# EAGLE design v1 (EAGLE 5.12)
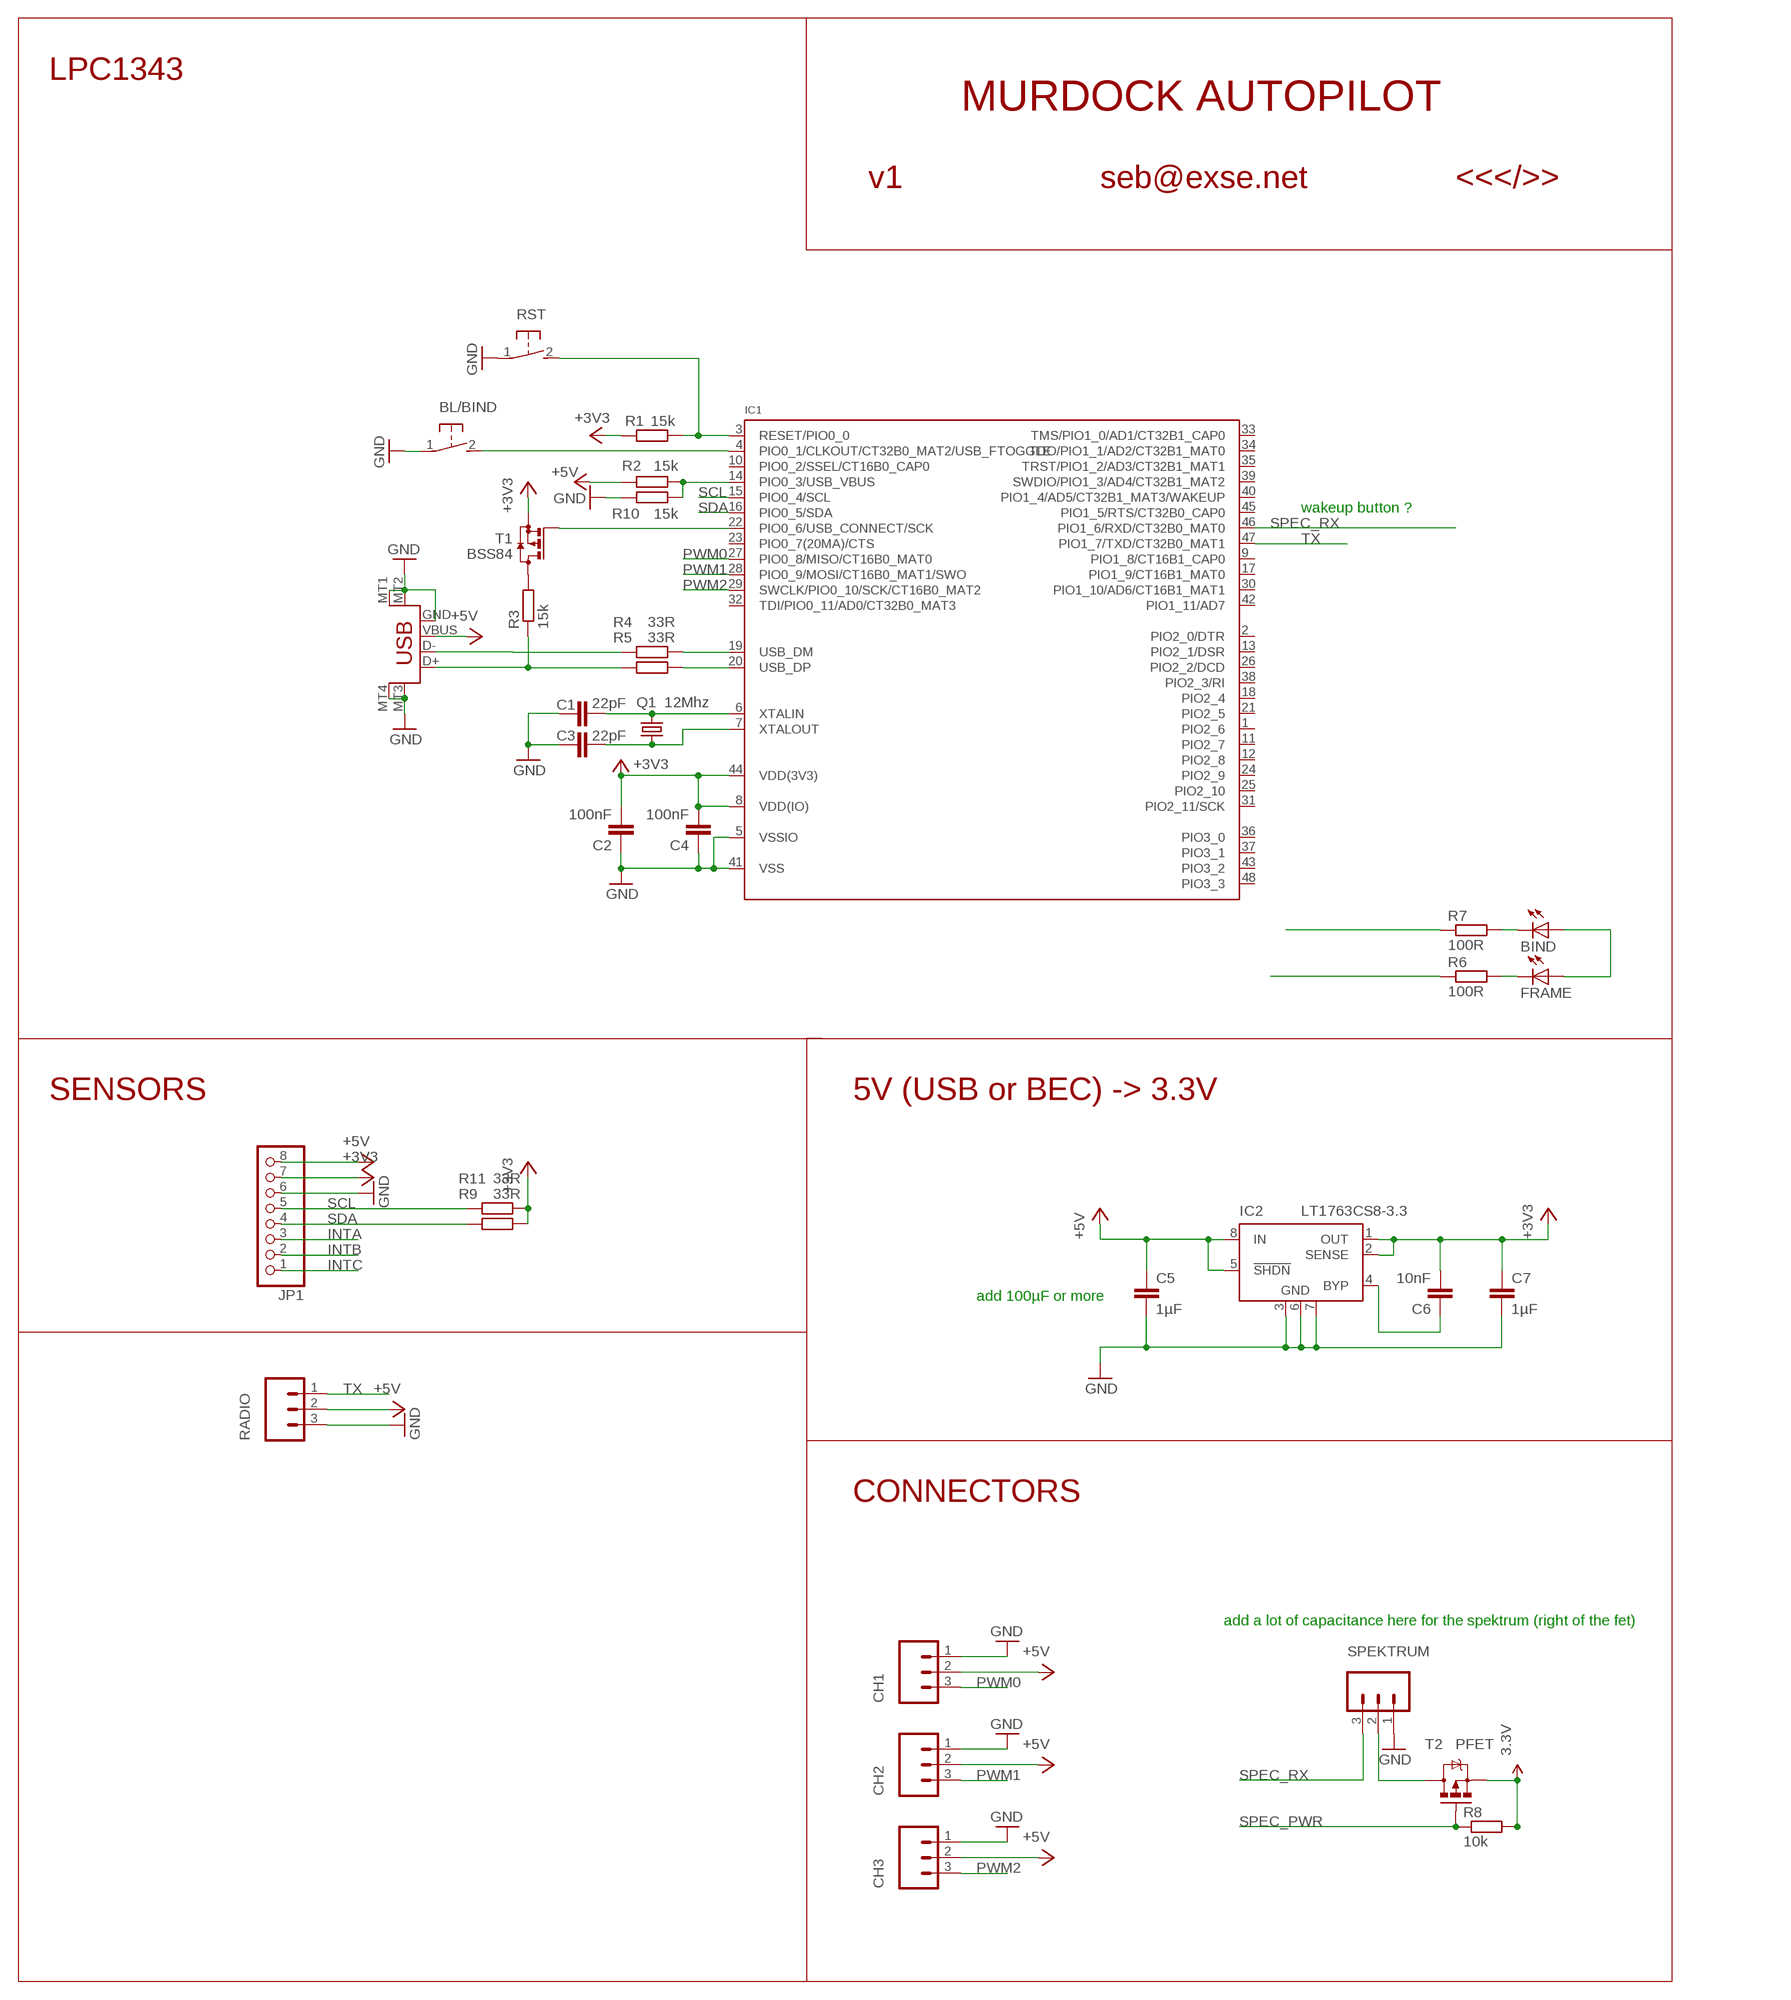
[diagram p0: schematic, sheet 1]

## Parts
BIND  LEDCHIPLED_0805  [CHIPLED_0805]
BL/BIND  SWITCH_MCTAEF  [SWITCH_MCTAEF]
C1  22pF  C-EUC0402  [C0402]
C2  100nF  C-EUC0402  [C0402]
C3  22pF  C-EUC0402  [C0402]
C4  100nF  C-EUC0402  [C0402]
C5  1µF  CAP0805  [0805]
C6  10nF  C-EUC0402  [C0402]
C7  1µF  CAP0805  [0805]
CH1  M03LONGPADS  [1X03_LONGPADS]
CH2  M03LONGPADS  [1X03_LONGPADS]
CH3  M03LONGPADS  [1X03_LONGPADS]
FRAME  LEDCHIPLED_0805  [CHIPLED_0805]
IC1  LPC1343_QFP  [LQFP48]
IC2  LT1763CS8-3.3  [SOIC8]
JP1  PINHD-1X8  [1X08]
Q1  12Mhz  MT-OSCILLATOR  [MT]
R1  15k  R-EU_R0402  [R0402]
R2  15k  R-EU_R0402  [R0402]
R3  15k  R-EU_R0402  [R0402]
R4  33R  R-EU_R0402  [R0402]
R5  33R  R-EU_R0402  [R0402]
R6  100R  R-EU_R0402  [R0402]
R7  100R  R-EU_R0402  [R0402]
R8  10k  R-EU_R0402  [R0402]
R9  33R  R-EU_R0402  [R0402]
R10  15k  R-EU_R0402  [R0402]
R11  33R  R-EU_R0402  [R0402]
RADIO  M03LONGPADS  [1X03_LONGPADS]
RST  SWITCH_MCTAEF  [SWITCH_MCTAEF]
SPEKTRUM  M03LONGPADS  [1X03_LONGPADS]
T1  BSS84  [SOT23]
T2  PFET  MOSFET-PCHANNEL  [SOT23]
X1  USB-MICROB  [USB-MICROB]

## Nets
3.3V: R8.2 T2.2(S)
+3V3: C2.2 C4.2 C6.2 C7.1 IC1.8(VDD(IO)) IC1.44(VDD(3V3)) IC2.1(OUT) IC2.2(SENSE) JP1.7 R1.2 R9.1 R11.1 T1.2(S)
+5V: C5.1 CH1.2 CH2.2 CH3.2 IC2.5(!SHDN) IC2.8(IN) JP1.8 R2.2 RADIO.2 X1.VBUS
GND: BL/BIND.1 C1.1 C2.1 C3.1 C4.1 C5.2 C7.2 CH1.1 CH2.1 CH3.1 IC1.5(VSSIO) IC1.41(VSS) IC2.3(GND) IC2.6(GND) IC2.7(GND) JP1.6 R10.2 RADIO.3 RST.1 SPEKTRUM.1 X1.GND X1.MT1(GND) X1.MT2(GND) X1.MT3(GND) X1.MT4(GND)
INTA: JP1.3
INTB: JP1.2
INTC: JP1.1
N$1: FRAME.C R6.2
N$2: SPEKTRUM.2 T2.3(D)
N$3: C3.2 IC1.7(XTALOUT) Q1.1
N$4: C1.2 IC1.6(XTALIN) Q1.3
N$5: C6.1 IC2.4(BYP)
N$6: BIND.C R7.2
N$7: IC1.3(RESET/PIO0_0) R1.1 RST.2
N$8: R3.2 T1.3(D)
N$9: IC1.22(PIO0_6/USB_CONNECT/SCK) T1.1(G)
N$10: R3.1 R5.2 X1.D+
N$11: R4.2 X1.D-
N$12: IC1.14(PIO0_3/USB_VBUS) R2.1 R10.1
N$13: R7.1
N$14: IC1.19(USB_DM) R4.1
N$15: R6.1
N$17: BIND.A FRAME.A
N$21: BL/BIND.2 IC1.4(PIO0_1/CLKOUT/CT32B0_MAT2/USB_FTOGGLE)
N$24: IC1.20(USB_DP) R5.1
PWM0: CH1.3 IC1.27(PIO0_8/MISO/CT16B0_MAT0)
PWM1: CH2.3 IC1.28(PIO0_9/MOSI/CT16B0_MAT1/SWO)
PWM2: CH3.3 IC1.29(SWCLK/PIO0_10/SCK/CT16B0_MAT2)
SCL: IC1.15(PIO0_4/SCL) JP1.5 R11.2
SDA: IC1.16(PIO0_5/SDA) JP1.4 R9.2
SPEC_PWR: R8.1 T2.1(G)
SPEC_RX: IC1.46(PIO1_6/RXD/CT32B0_MAT0) SPEKTRUM.3
TX: IC1.47(PIO1_7/TXD/CT32B0_MAT1) RADIO.1
Unconnected: IC1.1(PIO2_6) IC1.2(PIO2_0/DTR) IC1.9(PIO1_8/CT16B1_CAP0) IC1.10(PIO0_2/SSEL/CT16B0_CAP0) IC1.11(PIO2_7) IC1.12(PIO2_8) IC1.13(PIO2_1/DSR) IC1.17(PIO1_9/CT16B1_MAT0) IC1.18(PIO2_4) IC1.21(PIO2_5) IC1.23(PIO0_7(20MA)/CTS) IC1.24(PIO2_9) IC1.25(PIO2_10) IC1.26(PIO2_2/DCD) IC1.30(PIO1_10/AD6/CT16B1_MAT1) IC1.31(PIO2_11/SCK) IC1.32(TDI/PIO0_11/AD0/CT32B0_MAT3) IC1.33(TMS/PIO1_0/AD1/CT32B1_CAP0) IC1.34(TDO/PIO1_1/AD2/CT32B1_MAT0) IC1.35(TRST/PIO1_2/AD3/CT32B1_MAT1) IC1.36(PIO3_0) IC1.37(PIO3_1) IC1.38(PIO2_3/RI) IC1.39(SWDIO/PIO1_3/AD4/CT32B1_MAT2) IC1.40(PIO1_4/AD5/CT32B1_MAT3/WAKEUP) IC1.42(PIO1_11/AD7) IC1.43(PIO3_2) IC1.45(PIO1_5/RTS/CT32B0_CAP0) IC1.48(PIO3_3)

## Notes on the sheet
- LPC1343
- MURDOCK AUTOPILOT
- v1 | seb@exse.net | <<</>>
- wakeup button ?
- SENSORS | 5V (USB or BEC) -> 3.3V
- add 100µF or more
- CONNECTORS
- add a lot of capacitance here for the spektrum (right of the fet)

## Library data of the parts
BIND FRAME = led:LED: LED OSRAM: - CHIPLED LG R971, LG N971, LY N971, LG Q971, LY Q971, LO R971, LY R971 LH N974, LH R974 LS Q976, LO Q976, LY Q976 LO Q996 - Hyper CHIPLED LW Q18S LB Q993, LB Q99A, LB R99A - SideLED LS A670, LO A670, LY A670, LG A670, LP A670 LB A673, LV A673, LT A673, LW A673 LH A674 LY A675 LS A676, LA A676, LO A676, LY A676, LW A676 LS A679, LY A679, LG A679 - Hyper Micro SIDELED® LS Y876, LA Y876, LO Y876, LY Y876 LT Y87S - SmartLED LW L88C, LW L88S LB L89C, LB L89S, LG L890 LS L89K, LO L89K, LY L89K LS L896, LA L896, LO L896, LY L896 - TOPLED LS T670, LO T670, LY T670, LG T670, LP T670 LSG T670, LSP T670, LSY T670, LOP T670, LYG T670 LG T671, LOG T671, LSG T671 LB T673, LV T673, LT T673, LW T673 LH T674 LS T676, LA T676, LO T676, LY T676, LB T676, LH T676, LSB T676, LW T676 LB T67C, LV T67C, LT T67C, LS T67K, LO T67K, LY T67K, LW E67C LS E67B, LA E67B, LO E67B, LY E67B, LB E67C, LV E67C, LT E67C LW T67C LS T679, LY T679, LG T679 LS T770, LO T770, LY T770, LG T770, LP T770 LB T773, LV T773, LT T773, LW T773 LH T774 LS E675, LA E675, LY E675, LS T675 LS T776, LA T776, LO T776, LY T776, LB T776 LHGB T686 LT T68C, LB T68C - Hyper Mini TOPLED® LB M676 - Mini TOPLED Santana® LG M470 LS M47K, LO M47K, LY M47K Source: http://www.osram.convergy.de LUXEON: - LUMILED® LXK2-PW12-R00, LXK2-PW12-S00, LXK2-PW14-U00, LXK2-PW14-V00 LXK2-PM12-R00, LXK2-PM12-S00, LXK2-PM14-U00 LXK2-PE12-Q00, LXK2-PE12-R00, LXK2-PE12-S00, LXK2-PE14-T00, LXK2-PE14-U00 LXK2-PB12-K00, LXK2-PB12-L00, LXK2-PB12-M00, LXK2-PB14-N00, LXK2-PB14-P00, LXK2-PB14-Q00 LXK2-PR12-L00, LXK2-PR12-M00, LXK2-PR14-Q00, LXK2-PR14-R00 LXK2-PD12-Q00, LXK2-PD12-R00, LXK2-PD12-S00 LXK2-PH12-R00, LXK2-PH12-S00 LXK2-PL12-P00, LXK2-PL12-Q00, LXK2-PL12-R00 Source: www.luxeon.com KINGBRIGHT: KA-3528ASYC Source: www.kingbright.com
BL/BIND RST = seb:SWITCH_MCTAEF
C1-C4 C6 = rcl:C-EU: CAPACITOR, European symbol
C5 C7 = SparkFun:CAP: Capacitor Standard 0603 ceramic capacitor, and 0.1" leaded capacitor.
CH1-CH3 RADIO SPEKTRUM = SparkFun:M03: Header 3 Standard 3-pin 0.1" header. Use with straight break away headers (SKU : PRT-00116), right angle break away headers (PRT-00553), swiss pins (PRT-00743), machine pins (PRT-00117), and female headers (PRT-00115). Molex polarized connector foot print use with SKU : PRT-08232 with associated crimp pins and housings.
IC1 = microbuilder:LPC1343_QFP: LPC1343 72 MHz 32-bit ARM Cortex-M3 microcontroller. 32 kB Flash, 8 kB SRAM, USB Device Mouser: 771-LPC1343FBD48151 Digikey: 568-4945-ND; DIGIKEY#: 568-4945-ND; MANF: NXP; MANF#: LPC1343FBD48,151
IC2 = linear-technology:LT1763CS8: 500mA, Low Noise, LDO Micropower Regulators Source: http://cds.linear.com/docs/Datasheet/1763ff.pdf; MPN: LT1763CS8-3.3; OC_FARNELL: 1273617; OC_NEWARK: 57M6055
JP1 = pinhead:PINHD-1X8: PIN HEADER
Q1 = seb:MT-OSCILLATOR
R1-R11 = rcl:R-EU_: RESISTOR, European symbol
T1 = transistor-small-signal:BSS84: P-CHANNEL MOS FET
T2 = SparkFun:MOSFET-PCHANNEL
X1 = SparkFun:USB: USB Connectors USB-B-PTH is fully proven SKU : PRT-00139 USB-miniB is fully proven SKU : PRT-00587 USB-A-PCB is untested. USB-A-H is throughly reviewed, but untested. Spark Fun Electronics SKU : PRT-00437 USB-B-SMT is throughly reviewed, but untested. Needs silkscreen touching up. USB-A-S has not been used/tested USB-MB-H has not been used/tested

## Board
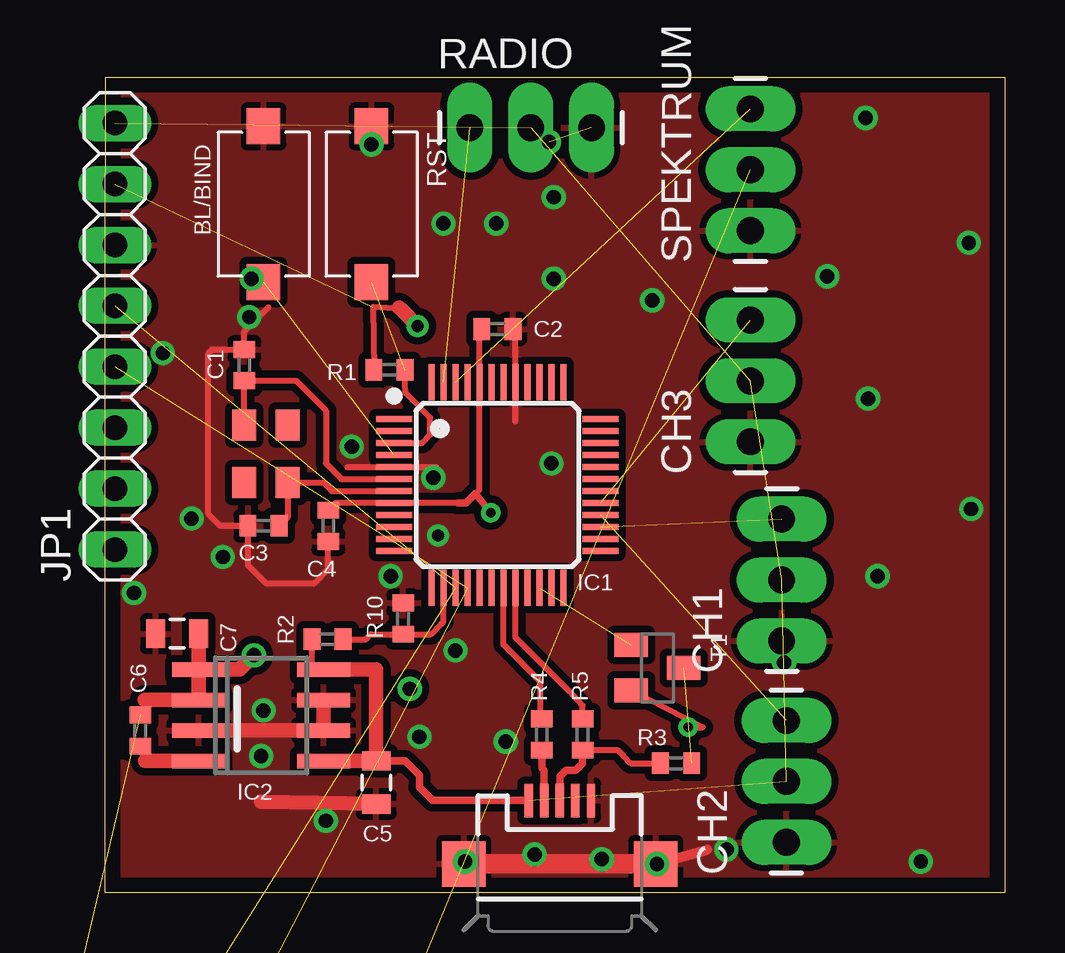
[diagram p1: board, top side]
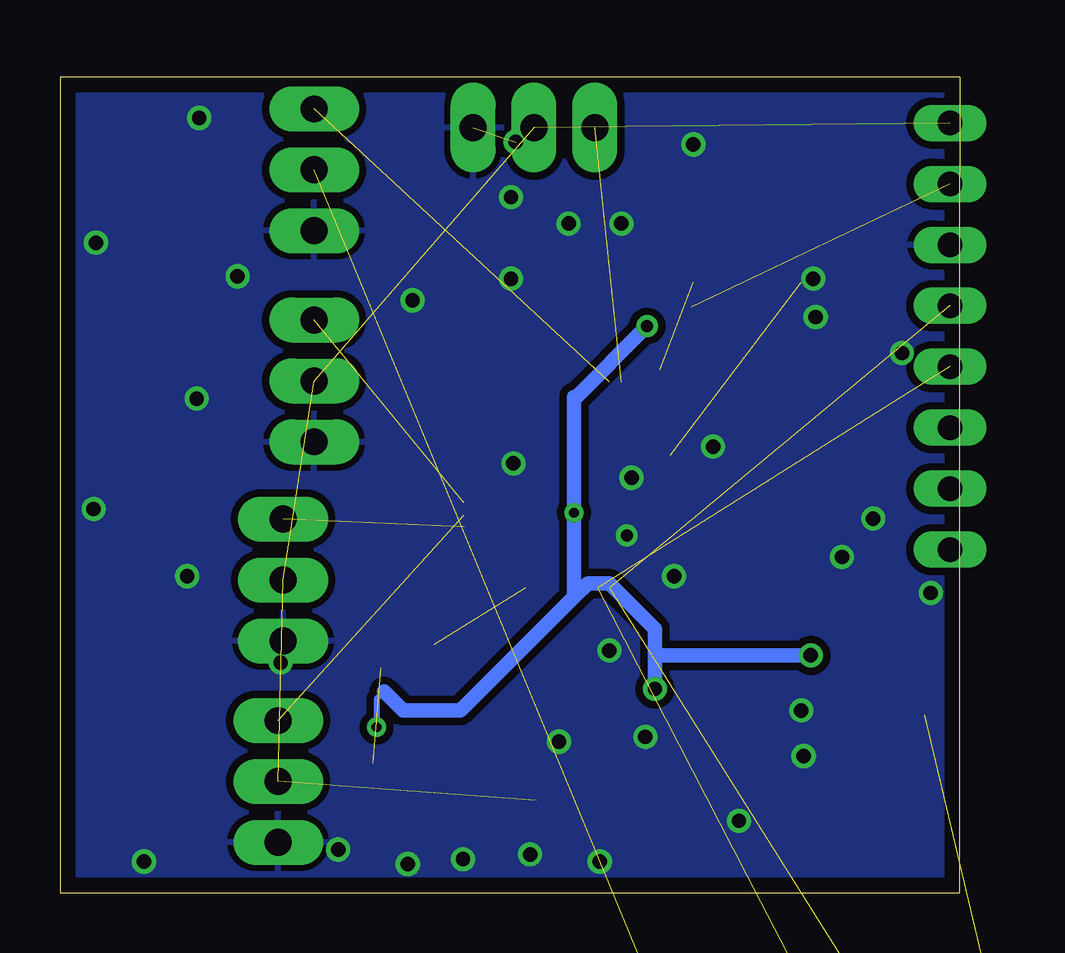
[diagram p2: board, bottom side, seen from below]

Size 37.5 x 34 mm. Coordinates in mm from the lower left corner, seen from the top.
Outline: 37.5,34 37.5,0 3.5,0 0,0 0,4 0,30 0,34 3.5,34 37.5,34
Copper layers (1*16): Top 0.035mm / dielectric 1.5mm / Bottom 0.035mm
Design rules "default *": minimum track width 9mil, minimum drill 0.4mm, track to track 8mil, track to pad 8mil, pad to pad 8mil, via to via 8mil, smd to smd 8mil, copper to edge 25mil, drill to drill 8mil, minimum pad ring 10mil, minimum via ring 8mil, stop-mask expansion 4mil, vias tented up to drill 30mil, thermal gap 10mil

### Footprints (pad centres in the part's own frame; a part is rotated, then mirrored left to right if it is on the bottom)
CHIPLED_0805 = smd 1.2 x 1.2: A 0,-1.05; C 0,1.05
SWITCH_MCTAEF = smd 1.5 x 1.4: 1 -3.25,0; 2 3.25,0
C0402 = smd 0.7 x 0.9: 1 -0.65,0; 2 0.65,0
0805 = smd 0.8 x 1.2: 1 -0.9,0; 2 0.9,0
1X03_LONGPADS = drill 1.118 pad 1.88 long: 1 0,0; 2 2.54,0; 3 5.08,0
LQFP48 = smd 1.5 x 0.25: 1 -4.3,2.75; 2 -4.3,2.25; 3 -4.3,1.75; 4 -4.3,1.25; 5 -4.3,0.75; 6 -4.3,0.25; 7 -4.3,-0.25; 8 -4.3,-0.75; 9 -4.3,-1.25; 10 -4.3,-1.75; 11 -4.3,-2.25; 12 -4.3,-2.75; 25 4.3,-2.75; 26 4.3,-2.25; 27 4.3,-1.75; 28 4.3,-1.25; 29 4.3,-0.75; 30 4.3,-0.25; 31 4.3,0.25; 32 4.3,0.75; 33 4.3,1.25; 34 4.3,1.75; 35 4.3,2.25; 36 4.3,2.75 | smd 0.25 x 1.5: 13 -2.75,-4.3; 14 -2.25,-4.3; 15 -1.75,-4.3; 16 -1.25,-4.3; 17 -0.75,-4.3; 18 -0.25,-4.3; 19 0.25,-4.3; 20 0.75,-4.3; 21 1.25,-4.3; 22 1.75,-4.3; 23 2.25,-4.3; 24 2.75,-4.3; 37 2.75,4.3; 38 2.25,4.3; 39 1.75,4.3; 40 1.25,4.3; 41 0.75,4.3; 42 0.25,4.3; 43 -0.25,4.3; 44 -0.75,4.3; 45 -1.25,4.3; 46 -1.75,4.3; 47 -2.25,4.3; 48 -2.75,4.3
SOIC8 = smd 0.6 x 2.2: 1 -1.905,-2.6; 2 -0.635,-2.6; 3 0.635,-2.6; 4 1.905,-2.6; 5 1.905,2.6; 6 0.635,2.6; 7 -0.635,2.6; 8 -1.905,2.6
1X08 = drill 1.016 long: 1 -8.89,0; 2 -6.35,0; 3 -3.81,0; 4 -1.27,0; 5 1.27,0; 6 3.81,0; 7 6.35,0; 8 8.89,0
MT = smd 1.3 x 1: 1 1.2,0.9; 2 -1.2,0.9; 3 -1.2,-0.9; 4 1.2,-0.9
R0402 = smd 0.7 x 0.9: 1 -0.65,0; 2 0.65,0
SOT23 = smd 1 x 1.4: 1 -0.95,-1.1; 2 0.95,-1.1; 3 0,1.1
USB-MICROB = smd 0.35 x 1.4: D+ 0,2.65; D- -0.65,2.65; GND 1.3,2.65; ID 0.65,2.65; VBUS -1.3,2.65 | smd 1.8 x 1.9: MT1 -4,0; MT2 4,0; MT3 -4,0; MT4 4,0

### Placement (x,y rotation side)
BIND  3.2,-21.5 0 top  (outside the outline)
BL/BIND  6.6,28.7 270 top
C1  5.8,22 270 top
C2  16.35,23.5 180 top
C3  6.6,15.3 0 top
C4  9.3,15.3 90 top
C5  11.3,4.6 270 top
C6  1.46,6.76 90 top
C7  3,10.8 180 top
CH1  28.2,10.5 90 top
CH2  28.4,2.1 90 top
CH3  26.9,18.8 90 top
FRAME  3.2,-7.5 0 top  (outside the outline)
IC1  16.35,17 0 top
IC2  6.5,7.4 270 top
JP1  0.4,23.2 90 top
Q1  6.7,18.3 270 top
R1  11.85,21.8 180 top
R2  9.27,10.57 180 top
R3  23.8,5.4 0 top
R4  18.2,6.6 270 top
R5  19.9,6.6 270 top
R6  9.8,-19.9 0 top  (outside the outline)
R7  1.5,-26.5 0 top  (outside the outline)
R8  8.1,-26.5 0 top  (outside the outline)
R9  -5.9,-26.5 0 top  (outside the outline)
R10  12.42,11.43 90 top
R11  -10.7,-26.5 0 top  (outside the outline)
RADIO  15.2,31.9 0 top
RST  11.1,28.7 270 top
SPEKTRUM  26.9,27.6 90 top
T1  23.02,9.38 270 top
T2  6.3,-20.8 0 top  (outside the outline)
X1  18.95,1.2 0 top

### Tracks (layer width: path | path; a pad name or v marks a point on that pad's centre or on a via)
3.3V  (1 unrouted)
+3V3  (via drill 0.4, 0.5, 0.6)  (3 unrouted)
  Top 0.254: C2.2 15.6,23.4 IC1.44 15.6,16.8 15.05,16.25 | C4.2 9.6,16.25 IC1.8 14.7,16.25 | R1.2 11.18,24.43 12.32,24.32 | C6.2 1.65,7.45 1.65,8.04 | T1.2 24.91,6.9 v24.3,6.9
  Top 0.305: 14.7,16.25 15.05,16.25 15.44,16.65 v16.07,15.85
  Top 0.61: IC2.1 4,9.3 | 1.65,8.04 IC2.2 IC2.1 | IC2.1 C7.1 | 12.25,24.4 12.32,24.32 v13.03,23.62 | v6.2,9.9 5.61,9.3 IC2.1
  Bottom 0.254: v24.3,6.9 24.3,8.1 24,8.4
  Bottom 0.61: 24,8.4 23.2,7.6 20.8,7.6 16.07,12.33 | 16.07,12.33 v16.07,15.85 16.07,20.67 16.08,20.57 v13.03,23.62 | v6.2,9.9 12.7,9.9 | 12.7,9.9 v12.7,8.5 | 16.07,12.33 15.5,12.9 14.6,12.9 12.7,11 12.7,9.9
+5V  (5 unrouted)
  Top 0.254: R2.2 8.62,9.3 IC2.8
  Top 0.305: X1.VBUS 13.65,3.85 13.1,4.4 13.1,4.9 12.8,5.2 12.5,5.5 C5.1
  Top 0.35: 10.9,5.5 11.25,5.85
  Top 0.61: C5.1 9.2,5.5 IC2.5 10.9,5.5 C5.1 | C5.1 11.3,9.3 IC2.8
GND  (via drill 0.5, 0.6)  (1 unrouted)
  Top 0.254: 17.1,19.65 IC1.41 17.1,23.4 C2.1 | C4.1 9.3,13.5 8.7,12.9 6.7,12.9 5.95,13.65 C3.1 4.8,15.3 4.3,15.8 4.3,22.5 4.45,22.65 C1.1 5.8,23.4 6.8,24.4 | 10.1,17.75 IC1.5 13.8,17.75 13.45,17.3 v13.68,17.3
  Top 0.406: X1.MT4 25.1,1.8
  Top 0.61: 6.5,3.8 C5.2 | IC2.3 IC2.6 IC2.7
  Top 0.813: X1.MT1 17.5,1.2 21.8,1.2 X1.MT4
  other vias: 31.7,32.3 30.1,25.7 11.1,31.2 6.1,25.6 6,24 18.5,31.3 4.9,14 11.9,13.2 6.6,7.6 6.5,5.7 17.9,1.6 20.7,1.4 34,1.3 36,27.1 31.8,20.6 22.8,24.7 13.88,14.9 16.7,6.3 23,1.2 15,1.3 36.1,16 13.1,6.5 18.7,29 10.28,18.6 14.6,10.1 32.2,13.2 16.3,27.9 14.1,27.9 28.3,9.6 1.2,12.5 3.6,15.6 18.6,17.9 25.9,1.8 9.2,3 2.4,22.5 18.7,25.6
  pour Top (isolate 0.305): 38,34.5 0,34.5 0,-0.5 38,-0.5
  pour Bottom (isolate 0.305): 38,34.5 0,34.5 0,-0.5 38,-0.5
N$1  (1 unrouted)
N$2  (1 unrouted)
N$3
  Top 0.254: IC1.7 9.45,16.75 9.1,17.1 Q1.1 7.6,15.65 C3.2
N$4
  Top 0.254: IC1.6 9.85,17.25 9.2,17.9 9.2,20.1 7.95,21.35 C1.2 Q1.3
N$5
  Top 0.254: C6.1 1.4,5.95 1.77,5.5
  Top 0.61: IC2.4 1.77,5.5 1.68,5.5
N$6  (1 unrouted)
N$7  (1 unrouted)
  Top 0.254: IC1.3 13.2,18.75 13.55,19.1 13.55,19.8 12.53,20.82 12.47,21.57 R1.1
N$8  (1 unrouted)
N$9  (1 unrouted)
N$10
  Top 0.254: R3.1 21.9,5.4 21.6,5.7 21.35,5.95 R5.2
  Top 0.305: X1.D+ 18.95,4.85 19.2,5.1 19.6,5.1 19.8,5.3 19.9,5.4 R5.2
N$11
  Top 0.305: X1.D- 18.3,5.1 18.2,5.2 R4.2
N$12
  Top 0.254: R2.1 10.87,10.57 10.9,10.6 11.08,10.78 R10.1 13.58,10.78 14,11.2 14.1,11.3 IC1.14
N$14
  Top 0.254: R4.1 18.15,7.55 18.15,8.8 16.6,10.35 IC1.19
N$17  (1 unrouted)
N$21  (1 unrouted)
N$24
  Top 0.254: IC1.20 17.1,10.65 19.35,8.4 19.9,7.8 R5.1
PWM0  (1 unrouted)
PWM1  (1 unrouted)
PWM2  (1 unrouted)
SCL  (2 unrouted)
SDA  (2 unrouted)
SPEC_PWR  (1 unrouted)
SPEC_RX  (1 unrouted)
TX  (1 unrouted)

### Text on the board
tValues: LPC1343 | 12Mhz
bStop: seb@exse.net | oled module v1